# Altium project PCB_Project.PrjPCB
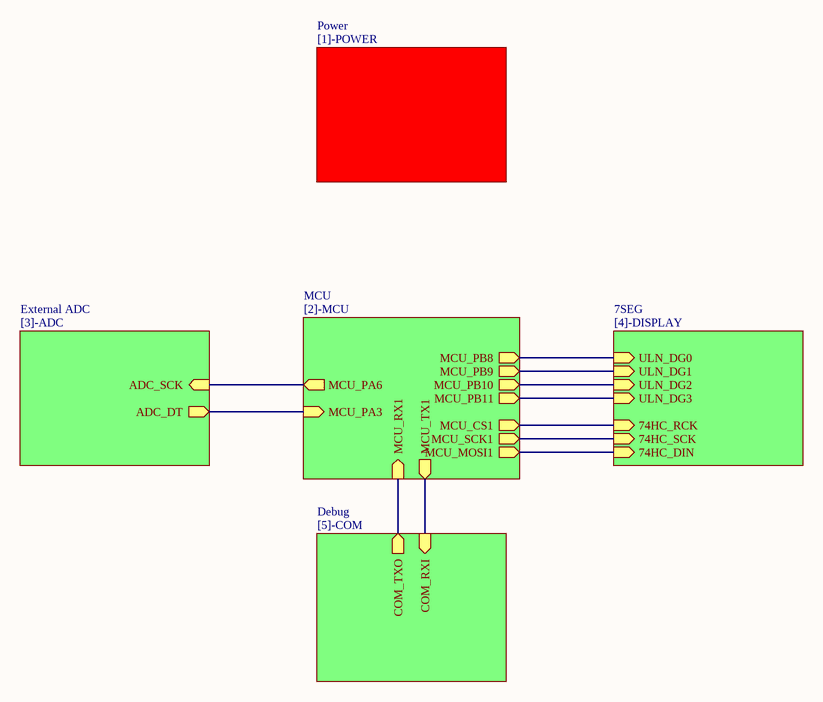
[diagram p0: connection.SchDoc]
6 sheets, 54 parts. Net scope: hierarchical (ports join the sheet entries above them; power ports are global).
Board file: PCB1.PcbDoc
Sheets:
  connection.SchDoc
    Power = [1]-POWER.SchDoc
    MCU = [2]-MCU.SchDoc
    External ADC = [3]-ADC.SchDoc
    7SEG = [4]-DISPLAY.SchDoc
    Debug = [5]-COM.SchDoc

## Sheet connection.SchDoc
size A

### Sub-sheets
7SEG = [4]-DISPLAY: ULN_DG0 (in), ULN_DG1 (in), ULN_DG2 (in), ULN_DG3 (in), 74HC_DIN (in), 74HC_RCK (in), 74HC_SCK (in)
Debug = [5]-COM: COM_TXO (out), COM_RXI (in)
External ADC = [3]-ADC: ADC_SCK (in), ADC_DT (out)
MCU = [2]-MCU: MCU_PA6 (out), MCU_PA3 (in), MCU_TX1 (out), MCU_RX1 (in), MCU_PB8 (out), MCU_PB9 (out), MCU_PB10 (out), MCU_PB11 (out), MCU_CS1 (out), MCU_SCK1 (out), MCU_MOSI1 (out)
Power = [1]-POWER: no entries

### Nets
NetIC5_1: sheet MCU/MCU_PB8, sheet 7SEG/ULN_DG0
NetIC5_2: sheet MCU/MCU_PB9, sheet 7SEG/ULN_DG1
NetIC5_3: sheet MCU/MCU_PB10, sheet 7SEG/ULN_DG2
NetIC5_4: sheet MCU/MCU_PB11, sheet 7SEG/ULN_DG3
NetU1_13: sheet MCU/MCU_PA3, sheet External ADC/ADC_DT
NetU1_14: sheet MCU/MCU_SCK1, sheet 7SEG/74HC_SCK
NetU1_15: sheet MCU/MCU_MOSI1, sheet 7SEG/74HC_DIN
NetU1_16: sheet MCU/MCU_PA6, sheet External ADC/ADC_SCK
NetU1_17: sheet MCU/MCU_CS1, sheet 7SEG/74HC_RCK
NetU1_30: sheet MCU/MCU_TX1, sheet Debug/COM_RXI
NetU1_31: sheet MCU/MCU_RX1, sheet Debug/COM_TXO

## Sheet [1]-POWER.SchDoc
size A
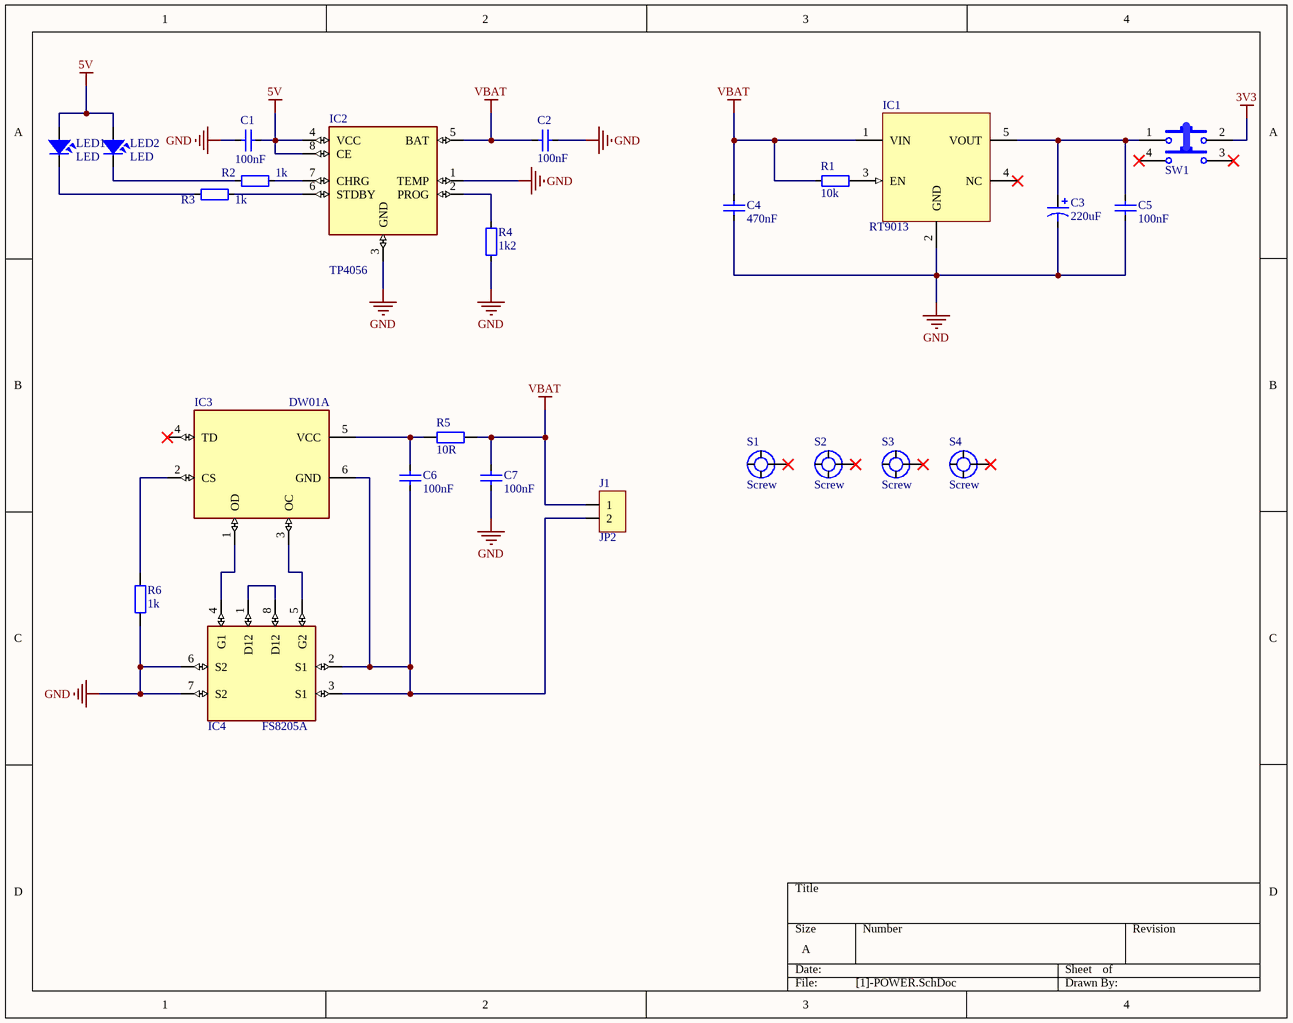
[diagram p1: [1]-POWER.SchDoc]

### Parts
C1  100nF  [CAP_0805]
C2  100nF  [CAP_0805]
C3  220uF  [CAP_TANTALUM_3216]
C4  470nF  [CAP_0805]
C5  100nF  [CAP_0805]
C6  100nF  [CAP_0805]
C7  100nF  [CAP_0805]
IC1  RT9013  [SOT23-5]
IC2  TP4056  [SOP127P600X175-9N]
IC3  DW01A  [SOT23-6]
IC4  FS8205A  [FS8205A]
J1  JP2  [CON2]
LED1  LED  [LED-0805-Red]
LED2  LED  [LED-0805-Green]
R1  10k  [RES-SMD-0805]
R2  1k  [RES-SMD-0805]
R3  1k  [RES-SMD-0805]
R4  1k2  [RES-SMD-0805]
R5  10R  [RES-SMD-0805]
R6  1k  [RES-SMD-0805]
S1  Screw  [Screw 3 small]
S2  Screw  [Screw 3 small]
S3  Screw  [Screw 3 small]
S4  Screw  [Screw 3 small]
SW1  SW-4P-B  [SW-4P-B]  (value not drawn)

### Nets
3V3: SW1.2
5V: C1.1 IC2.4(VCC) IC2.8(CE) LED1.1 LED2.1
GND: C1.2 C2.1 C3.2 C4.2 C5.2 C7.1 IC1.2(GND) IC2.1(TEMP) IC2.3(GND) IC4.6(S2) IC4.7(S2) R4.1 R6.2
VBAT: C2.2 C4.1 C7.2 IC1.1(VIN) IC2.5(BAT) J1.1 R1.2 R5.2
NetC3_1: C3.1 C5.1 IC1.5(VOUT) SW1.1
NetC6_1: C6.1 IC3.6(GND) IC4.2(S1) IC4.3(S1) J1.2
NetC6_2: C6.2 IC3.5(VCC) R5.1
NetIC1_3: IC1.3(EN) R1.1
NetIC2_2: IC2.2(PROG) R4.2
NetIC2_6: IC2.6(STDBY) R3.1
NetIC2_7: IC2.7(CHRG) R2.1
NetIC3_1: IC3.1(OD) IC4.4(G1)
NetIC3_2: IC3.2(CS) R6.1
NetIC3_3: IC3.3(OC) IC4.5(G2)
NetIC4_1: IC4.1(D12) IC4.8(D12)
NetLED1_2: LED1.2 R3.2
NetLED2_2: LED2.2 R2.2

Not connected (* = marked no-connect by the designer): IC1 4(NC)*; IC3 4(TD)*; S1 1*; S2 1*; S3 1*; S4 1*; SW1 3* 4*

### Library data of the parts
C1 C2 C4-C7 = CapSMD: Capacitor; Value: 33p; Published: 8-Jun-2000; LatestRevisionDate: 17-Jul-2002; LatestRevisionNote: Re-released for DXP Platform.; PackageReference: RAD-0.3; Publisher: Altium Limited
C3 = Cap Pol: Polarized Capacitor (Axial); Published: 8-Jun-2000; LatestRevisionDate: 17-Jul-2002; LatestRevisionNote: Re-released for DXP Platform.; PackageReference: POLAR0.8; Publisher: Altium Limited
IC1 = RT9013: RT9013-33GB IC REG LINEAR 3.3V 500mA SOT23-5
IC2 = TP4056: Complete single cell Li-Ion battery with a constant current / constant voltage linear charger
IC3 = DW01A: One Cell Lithium-ion/Polymer Battery Protection IC
J1 = JP2: WR-PHD 2.54 mm Angled Socket Header; Manufacturer: W¨¹rth Elektronik eiSos GmbH; partNo: 613002143121; ComponentLink1 Description: Manufacturer; ComponentLink2 Description: Datasheet; NoPins: 02; Created Date: 29 March 2013; ComponentLink1URL: http://www.we-online.com; ComponentLink2URL: http://katalog.we-online.de/em/datasheet/6130xx143121.pdf; Created by: Karrer Zheng
LED1 LED2 = LED: LED Single colour Green and Red; Value: LED 3 ly Single Colour
R1-R4 = Resistor - SMD: Resistor; Manufacturer: Generic Components; Class: Passive; Published: 08/06/2000; Publisher: Altium Hobart Technology Centre
R5 R6 = Resistor - SMD: Resistor SMD; Manufacturer: Generic Components; Class: Passive; Published: 08/06/2000; Publisher: Altium Hobart Technology Centre
SW1 = SW-4PIN-BIG: Switch Big 4 Pin; Published: 24-Mar-1999; LatestRevisionDate: 17-Jul-2002; LatestRevisionNote: Re-released for DXP Platform.; PackageReference: SPST-2; Publisher: Altium Limited

## Sheet [2]-MCU.SchDoc
size A
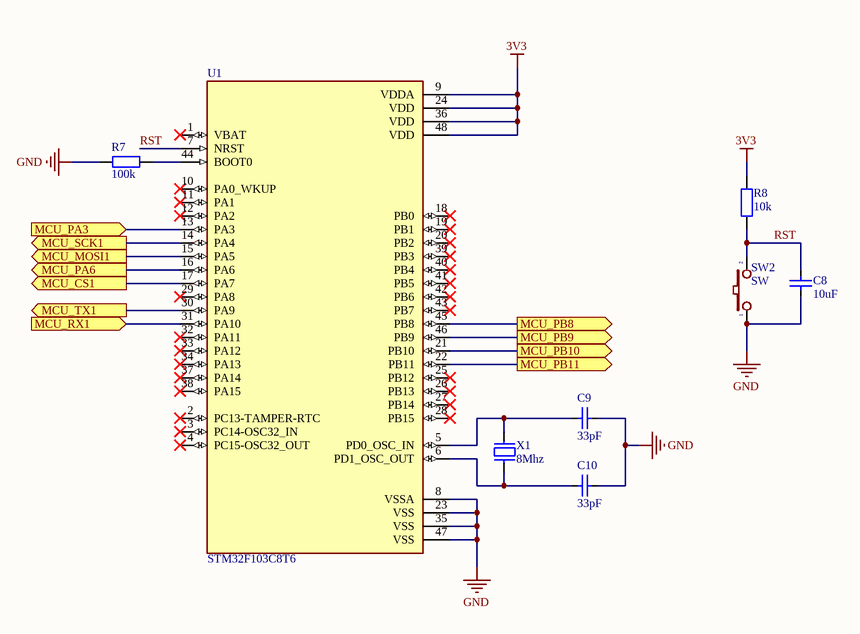
[diagram p2: [2]-MCU.SchDoc]

### Parts
C8  10uF  [CAP_0805]
C9  33pF  [CAP_0805]
C10  33pF  [CAP_0805]
R7  100k  [RES-SMD-0805]
R8  10k  [RES-SMD-0805]
SW2  SW  [SW-SMD]
U1  STM32F103C8T6  [QFP50P900X900X160-48N]
X1  8Mhz  [X2-SMD-5.0X3.2X1.3MM]

### Ports
MCU_CS1 (out), MCU_MOSI1 (out), MCU_PA3 (in), MCU_PA6 (out), MCU_PB8 (out), MCU_PB9 (out), MCU_PB10 (out), MCU_PB11 (out), MCU_RX1 (in), MCU_SCK1 (out), MCU_TX1 (out)

### Nets
3V3: R8.1 U1.9(VDDA) U1.24(VDD) U1.36(VDD) U1.48(VDD)
GND: C8.1 C9.2 C10.2 R7.1 SW2.1 U1.8(VSSA) U1.23(VSS) U1.35(VSS) U1.47(VSS)
RST: C8.2 R8.2 SW2.2 U1.7(NRST)
NetC9_1: C9.1 U1.5(PD0_OSC_IN) X1.2
NetC10_1: C10.1 U1.6(PD1_OSC_OUT) X1.1
NetIC5_1: U1.45(PB8) ; port MCU_PB8
NetIC5_2: U1.46(PB9) ; port MCU_PB9
NetIC5_3: U1.21(PB10) ; port MCU_PB10
NetIC5_4: U1.22(PB11) ; port MCU_PB11
NetR7_2: R7.2 U1.44(BOOT0)
NetU1_13: U1.13(PA3) ; port MCU_PA3
NetU1_14: U1.14(PA4) ; port MCU_SCK1
NetU1_15: U1.15(PA5) ; port MCU_MOSI1
NetU1_16: U1.16(PA6) ; port MCU_PA6
NetU1_17: U1.17(PA7) ; port MCU_CS1
NetU1_30: U1.30(PA9) ; port MCU_TX1
NetU1_31: U1.31(PA10) ; port MCU_RX1

Not connected (* = marked no-connect by the designer): U1 1(VBAT)* 2(PC13-TAMPER-RTC)* 3(PC14-OSC32_IN)* 4(PC15-OSC32_OUT)* 10(PA0_WKUP)* 11(PA1)* 12(PA2)* 18(PB0)* 19(PB1)* 20(PB2)* 25(PB12)* 26(PB13)* 27(PB14)* 28(PB15)* 29(PA8)* 32(PA11)* 33(PA12)* 34(PA13)* 37(PA14)* 38(PA15)* 39(PB3)* 40(PB4)* 41(PB5)* 42(PB6)* 43(PB7)*

### Library data of the parts
C8-C10 = CapSMD: Capacitor; Value: 33p; Published: 8-Jun-2000; LatestRevisionDate: 17-Jul-2002; LatestRevisionNote: Re-released for DXP Platform.; PackageReference: RAD-0.3; Publisher: Altium Limited
R7 R8 = Resistor - SMD: as R5 on sheet [1]-POWER; Published: 08/06/2000; Publisher: Altium Hobart Technology Centre
SW2 = SW2: Switch button 2 pin; Value: SW chip 2 pin
U1 = STM32F103C8T6: ARMÂ® CortexÂ®-M3 STM32F1 Microcontroller IC 32-Bit 72MHz 64KB (64K x 8) FLASH 48-LQFP (7x7); MF: STMicroelectronics; Price: None; Availability: In Stock; MP: STM32F103C8T6; Package: LQFP-48 STMicroelectronics; SnapEDA_Link: https://www.snapeda.com/parts/STM32F103C8T6/STMicroelectronics/view-part/?ref=snap; Check_prices: https://www.snapeda.com/parts/STM32F103C8T6/STMicroelectronics/view-part/?ref=eda; Value: *; Purchase-URL: https://pricing.snapeda.com/search/part/STM32F103C8T6/?ref=eda
X1 = XT2: Crystal For all Crystal 2pin.; Value: 4Mhz

## Sheet [3]-ADC.SchDoc
size A
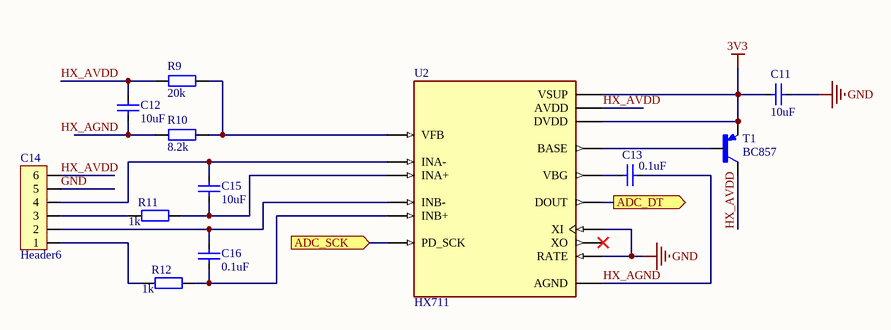
[diagram p3: [3]-ADC.SchDoc]

### Parts
C11  10uF  [CAP_0805]
C12  10uF  [CAP_0805]
C13  0.1uF  [CAP_0805]
C14  Header6  [CON6]
C15  10uF  [CAP_0805]
C16  0.1uF  [CAP_0805]
R9  20k  [RES-SMD-0805]
R10  8.2k  [RES-SMD-0805]
R11  1k  [RES-SMD-0805]
R12  1k  [RES-SMD-0805]
T1  BC857  [SOT23-BEC]
U2  HX711  [SOP127P600X180-16N]

### Ports
ADC_DT (out), ADC_SCK (in)

### Nets
3V3: C11.2 T1.E U2.1(VSUP) U2.16(DVDD)
GND: C11.1 C14.5 U2.14(XI) U2.15(RATE)
HX_AGND: C13.1 U2.5(AGND)
HX_AVDD: C12.2 C14.6 R9.1 T1.C U2.3(AVDD)
NetC12_1: C12.1 R10.1
NetC13_2: C13.2 U2.6(VBG)
NetC14_1: C14.1 R12.1
NetC14_2: C14.2 C16.2 U2.9(INB-)
NetC14_3: C14.3 R11.1
NetC14_4: C14.4 C15.2 U2.7(INA-)
NetC15_1: C15.1 R11.2 U2.8(INA+)
NetC16_1: C16.1 R12.2 U2.10(INB+)
NetR9_2: R9.2 R10.2 U2.4(VFB)
NetT1_B: T1.B U2.2(BASE)
NetU1_13: U2.12(DOUT) ; port ADC_DT
NetU1_16: U2.11(PD_SCK) ; port ADC_SCK

Not connected (* = marked no-connect by the designer): U2 13(XO)*

### Notes on the sheet
- Labels drawn without touching a wire or pin: HX_AGND

### Library data of the parts
C11-C13 C15 C16 = CapSMD: Capacitor; Value: 33p; Published: 8-Jun-2000; LatestRevisionDate: 17-Jul-2002; LatestRevisionNote: Re-released for DXP Platform.; PackageReference: RAD-0.3; Publisher: Altium Limited
C14 = Header6: Header IDC, 6 x 1 Pin Vertical 2.54mm Pitch (Non-Boxed, Male); Manufacturer: W¨¹rth Elektronik eiSos GmbH; partNo: 613002143121; ComponentLink1 Description: Manufacturer; ComponentLink2 Description: Datasheet; NoPins: 02; Created Date: 29 March 2013; ComponentLink1URL: http://www.we-online.com; ComponentLink2URL: http://katalog.we-online.de/em/datasheet/6130xx143121.pdf; Created by: Karrer Zheng
R9-R12 = Resistor - SMD: as R5 on sheet [1]-POWER; Published: 08/06/2000; Publisher: Altium Hobart Technology Centre
T1 = BC857: Transistor PNP BC857 PHILIPS Ampere=1 V=30 SO; MF: Nexperia USA; Package: SOT-23 NXP Semiconductors; Value: *; Price: None; MP: BC857; SnapEDA_Link: https://www.snapeda.com/parts/BC857/Nexperia%20USA%20Inc./view-part/53064/?ref=snap; Availability: Unavailable
U2 = HX711: Precision 24-bit analog-to-digital converter (ADC) designed for weigh scales and industrial control applications to interface directly with a bridge sensor.; MF: AVIA SEMICONDUCTOR; MP: HX711; Value: *; Availability: Not in stock; Package: None; SnapEDA_Link: https://www.snapeda.com/parts/HX711/AVIA+SEMICONDUCTOR/view-part/?ref=snap; Price: None; Check_prices: https://www.snapeda.com/parts/HX711/AVIA+SEMICONDUCTOR/view-part/?ref=eda

## Sheet [4]-DISPLAY.SchDoc
size A
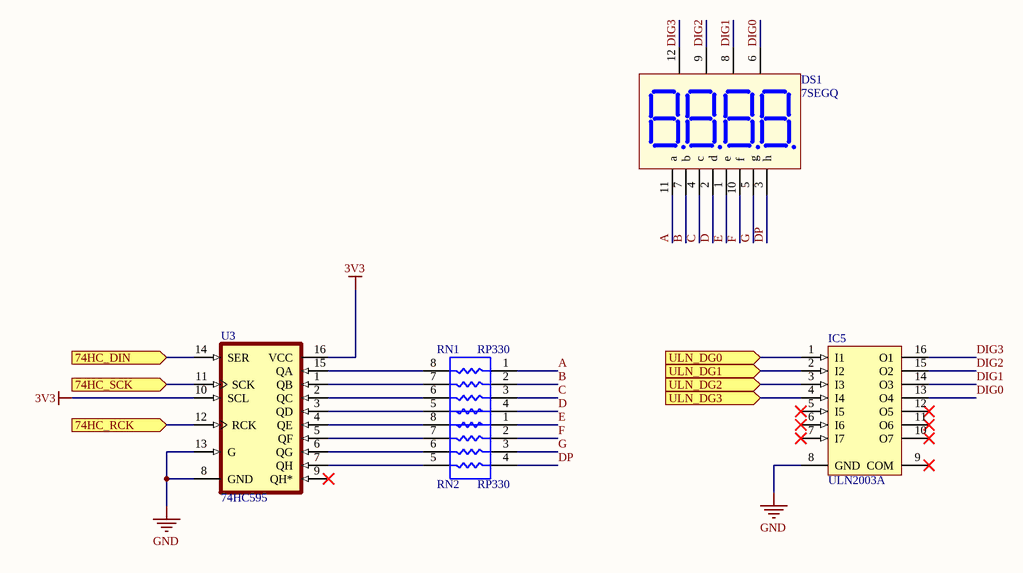
[diagram p4: [4]-DISPLAY.SchDoc]

### Parts
DS1  7SEGQ  [LED7SEG-4-0.36]
IC5  ULN2003A  [SOIC16]
RN1  RP330  [RN4-0805]
RN2  RP330  [RN4-0805]
U3  74HC595  [SOIC16]

### Ports
74HC_DIN (in), 74HC_RCK (in), 74HC_SCK (in), ULN_DG0 (in), ULN_DG1 (in), ULN_DG2 (in), ULN_DG3 (in)

### Nets
3V3: U3.10(SCL) U3.16(VCC)
GND: IC5.8(GND) U3.8(GND) U3.13(G)
A: DS1.11(a) RN1.1
B: DS1.7(b) RN1.2
C: DS1.4(c) RN1.3
D: DS1.2(d) RN1.4
DIG0: DS1.6(V4) IC5.13(O4)
DIG1: DS1.8(V3) IC5.14(O3)
DIG2: DS1.9(V2) IC5.15(O2)
DIG3: DS1.12(V1) IC5.16(O1)
DP: DS1.3(h) RN2.4
E: DS1.1(e) RN2.1
F: DS1.10(f) RN2.2
G: DS1.5(g) RN2.3
NetIC5_1: IC5.1(I1) ; port ULN_DG0
NetIC5_2: IC5.2(I2) ; port ULN_DG1
NetIC5_3: IC5.3(I3) ; port ULN_DG2
NetIC5_4: IC5.4(I4) ; port ULN_DG3
NetRN1_5: RN1.5 U3.3(QD)
NetRN1_6: RN1.6 U3.2(QC)
NetRN1_7: RN1.7 U3.1(QB)
NetRN1_8: RN1.8 U3.15(QA)
NetRN2_5: RN2.5 U3.7(QH)
NetRN2_6: RN2.6 U3.6(QG)
NetRN2_7: RN2.7 U3.5(QF)
NetRN2_8: RN2.8 U3.4(QE)
NetU1_14: U3.11(SCK) ; port 74HC_SCK
NetU1_15: U3.14(SER) ; port 74HC_DIN
NetU1_17: U3.12(RCK) ; port 74HC_RCK

Not connected (* = marked no-connect by the designer): IC5 5(I5)* 6(I6)* 7(I7)* 9(COM)* 10(O7)* 11(O6)* 12(O5)*; U3 9(QH*)*

### Library data of the parts
DS1 = LED7SEG-4: Four 7 Seg Dipslay; Value: LED 7Q SEG
IC5 = ULN2003A: High-Voltage, High-Current Darlington Array; LatestRevisionNote: Stylized 3D Model Added.; Publisher: Altium Limited; Value: ULN2003A
RN1 RN2 = RN4-Dual
U3 = 74HC595: 8-bit Serial-Input/Serial or Parallel Output Shift Register with Latched 3-state Outputs

## Sheet [5]-COM.SchDoc
size A
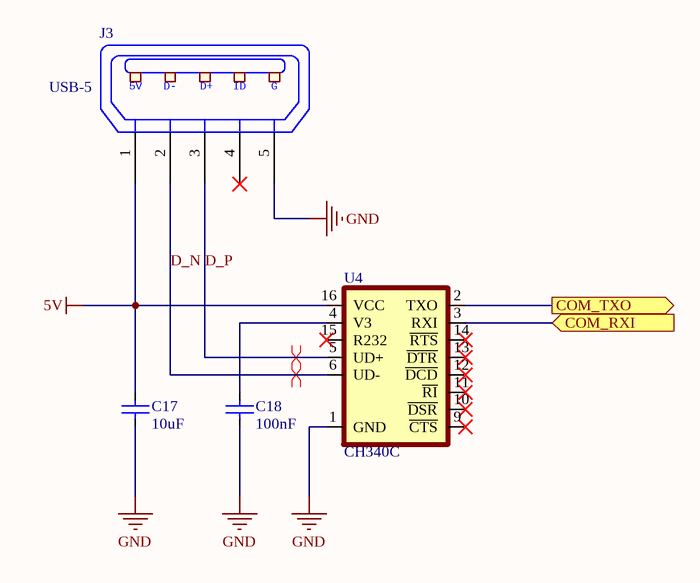
[diagram p5: [5]-COM.SchDoc]

### Parts
C17  10uF  [CAP_0805]
C18  100nF  [CAP_0805]
J3  USB-5  [USB-M1]
U4  CH340C  [SO16]

### Ports
COM_RXI (in), COM_TXO (out)

### Nets
5V: C17.2 J3.1(P1) U4.16(VCC)
GND: C17.1 C18.1 J3.5(P5) U4.1(GND)
D_N: J3.2(P2) U4.6(UD-)
D_P: J3.3(P3) U4.5(UD+)
NetC18_2: C18.2 U4.4(V3)
NetU1_30: U4.3(RXI) ; port COM_RXI
NetU1_31: U4.2(TXO) ; port COM_TXO

Not connected (* = marked no-connect by the designer): J3 4(P4)*; U4 9(~{CTS})* 10(~{DSR})* 11(~{RI})* 12(~{DCD})* 13(~{DTR})* 14(~{RTS})* 15(R232)*

### Layout directives
differential pair: D_N, D_P

### Notes on the sheet
- (in symbol USB-5) 5V; D-; D+; ID; G

### Library data of the parts
C17 C18 = CapSMD: Capacitor; Value: 33p; Published: 8-Jun-2000; LatestRevisionDate: 17-Jul-2002; LatestRevisionNote: Re-released for DXP Platform.; PackageReference: RAD-0.3; Publisher: Altium Limited
J3 = USB-5: Manufacturer: FCI; Manufacturer Part Number: 10118193-0001LF; Connector Type: USB - micro B; Number of Contacts: 5; Gender: Receptacle; Specifications: USB 2.0; .Creator: MM; .Checked PCB: RF; Supplier 1: Digi-Key; RoHS: RoHS Compliant; Category: Connectors, Interconnects; Stock 1: 28642; Pricing 1: 1=0.46, 10=0.433, 25=0.3712, 50=0.3156, 100=0.3032, 250=0.27224, 500=0.25988 (USD); Packaging: Cut Tape (CT); Mounting Type: Surface Mount, Right Angle, Horizontal; Features: Shielded, Solder Retention; Ingress Protection: -; ComponentLink1URL: http://portal.fciconnect.com/Comergent//fci/drawing/10118193.pdf; ComponentLink1Description: http://portal.fciconnect.com/Comergent//fci/drawing/10118193.pdf; Supplier Part Number 1: 609-4616-1-ND; .Checked SCH: MM
U4 = CH340C: USB to serial chip CH340; MF: WCH; Package: Package; Check_prices: https://www.snapeda.com/parts/CH340C/WCH/view-part/5428851/?ref=eda; Value: *; Price: None; MP: CH340C; Availability: Unavailable; SnapEDA_Link: https://www.snapeda.com/parts/CH340C/WCH/view-part/5428851/?ref=snap

## Nets that join several sheets
3V3: [1]-POWER (SW1.2), [2]-MCU (5 pins), [3]-ADC (C11.2 T1.E U2.1 U2.16), [4]-DISPLAY (U3.10 U3.16)
5V: [1]-POWER (5 pins), [5]-COM (C17.2 J3.1 U4.16)
GND: [1]-POWER (13 pins), [2]-MCU (9 pins), [3]-ADC (C11.1 C14.5 U2.14 U2.15), [4]-DISPLAY (IC5.8 U3.8 U3.13), [5]-COM (C17.1 C18.1 J3.5 U4.1)
NetIC5_1: [2]-MCU (U1.45), [4]-DISPLAY (IC5.1)
NetIC5_2: [2]-MCU (U1.46), [4]-DISPLAY (IC5.2)
NetIC5_3: [2]-MCU (U1.21), [4]-DISPLAY (IC5.3)
NetIC5_4: [2]-MCU (U1.22), [4]-DISPLAY (IC5.4)
NetU1_13: [2]-MCU (U1.13), [3]-ADC (U2.12)
NetU1_14: [2]-MCU (U1.14), [4]-DISPLAY (U3.11)
NetU1_15: [2]-MCU (U1.15), [4]-DISPLAY (U3.14)
NetU1_16: [2]-MCU (U1.16), [3]-ADC (U2.11)
NetU1_17: [2]-MCU (U1.17), [4]-DISPLAY (U3.12)
NetU1_30: [2]-MCU (U1.30), [5]-COM (U4.3)
NetU1_31: [2]-MCU (U1.31), [5]-COM (U4.2)